# EAGLE design Maqam v2 (EAGLE 9.2.2)

## Sheet 1 of 2: Maqam v2.0 Board
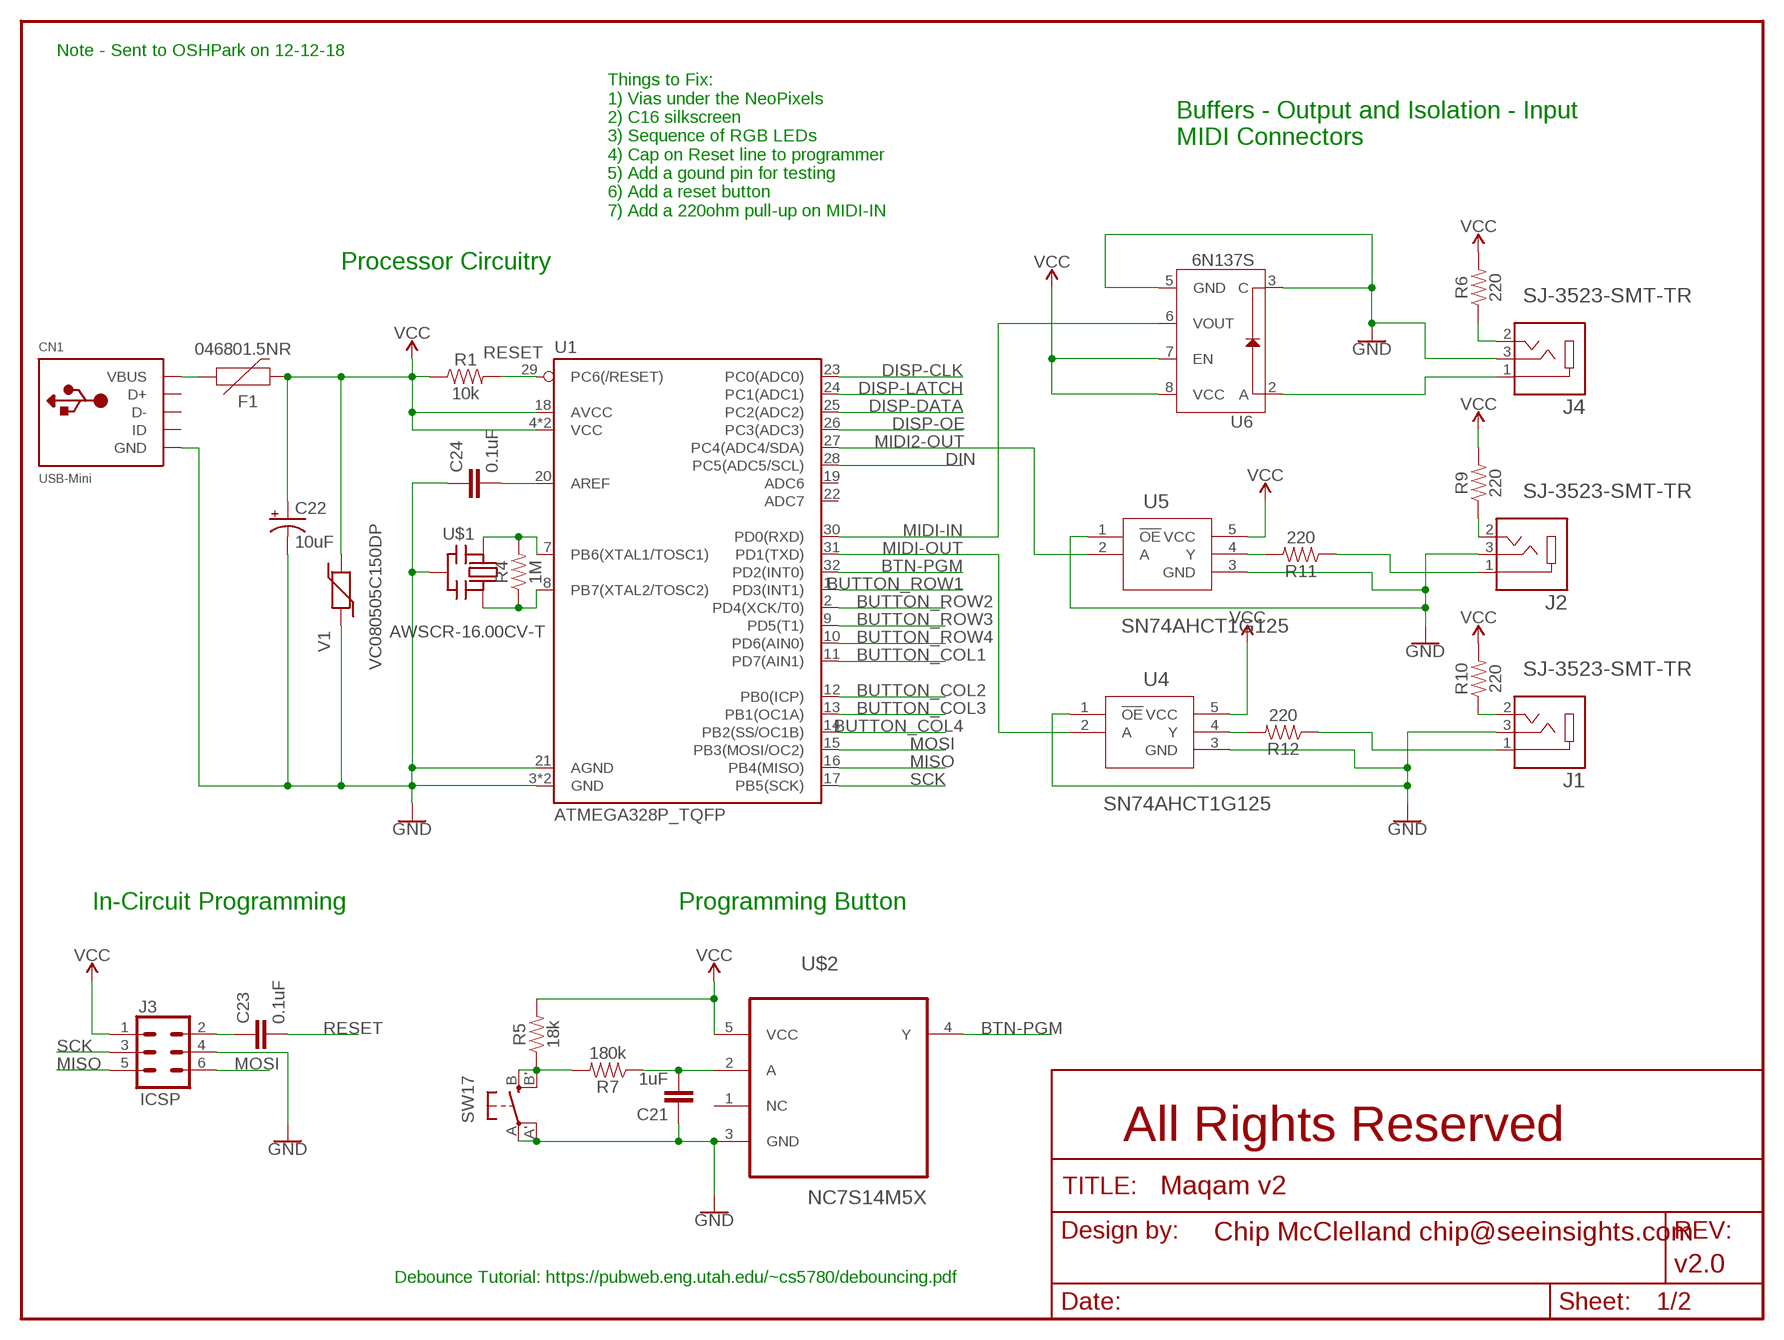
[diagram p0: schematic, sheet 1]

### Parts
C21  1uF  1.0UF-0805-25V-(+80/-20%)  [0805]
C22  10uF  10UF-POLAR-EIA3216-16V-10%(TANT)  [EIA3216]
C23  0.1uF  1.0UF-0805-25V-(+80/-20%)  [0805]
C24  0.1uF  1.0UF-0805-25V-(+80/-20%)  [0805]
CN1  USB-Mini  USBMINIB  [USB-MINIB]
F1  046801.5NR  PPTC_HALF-AMP  [1206]
FRAME2  FRAME-LETTERNO_PACKAGE  [DUMMY]
J1  SJ-3523-SMT-TR  [CUI_SJ-3523-SMT-TR]
J2  SJ-3523-SMT-TR  [CUI_SJ-3523-SMT-TR]
J3  ICSP  CONN_03X2SHROUD  [2X3-SHROUDED]
J4  SJ-3523-SMT-TR  [CUI_SJ-3523-SMT-TR]
R1  10k  RESISTOR0805  [0805]
R4  1M  RESISTOR0805  [0805]
R5  18k  RESISTOR0805  [0805]
R6  220  RESISTOR0805  [0805]
R7  180k  RESISTOR0805  [0805]
R9  220  RESISTOR0805  [0805]
R10  220  RESISTOR0805  [0805]
R11  220  RESISTOR0805  [0805]
R12  220  RESISTOR0805  [0805]
SW17  SPST_TACT-EVQQ2  [EVQ-Q2]
U1  ATMEGA328P_TQFP  [TQFP32-08]
U4  SN74AHCT1G125  SN74AHCT1G125DBVRDBV5-L  [DBV5-L]
U5  SN74AHCT1G125  SN74AHCT1G125DBVRDBV5-L  [DBV5-L]
U6  6N137S  [8-SMD]
U$1  AWSCR-16.00CV-T  CERMOSCILL  [AWSCR]
U$2  NC7S14M5X  [SOT-23-5]
V1  VC080505C150DP  VARISTOR  [0805]

### Nets
BTN-PGM: U1.32(PD2(INT0)) U$2.4(Y)
BUTTON_COL1: U1.11(PD7(AIN1)) ; also sheet 2
BUTTON_COL2: U1.12(PB0(ICP)) ; also sheet 2
BUTTON_COL3: U1.13(PB1(OC1A)) ; also sheet 2
BUTTON_COL4: U1.14(PB2(SS/OC1B)) ; also sheet 2
BUTTON_ROW1: U1.1(PD3(INT1)) ; also sheet 2
BUTTON_ROW2: U1.2(PD4(XCK/T0)) ; also sheet 2
BUTTON_ROW3: U1.9(PD5(T1)) ; also sheet 2
BUTTON_ROW4: U1.10(PD6(AIN0)) ; also sheet 2
DIN: U1.28(PC5(ADC5/SCL)) ; also sheet 2
DISP-CLK: U1.23(PC0(ADC0)) ; also sheet 2
DISP-DATA: U1.25(PC2(ADC2)) ; also sheet 2
DISP-LATCH: U1.24(PC1(ADC1)) ; also sheet 2
DISP-OE: U1.26(PC3(ADC3)) ; also sheet 2
GND: C21.1 C22.- C24.1 CN1.GND J1.3 J2.3 J3.4 J4.3 SW17.A'(P1) SW17.A(P) U1.3(GND) U1.5(GND) U1.21(AGND) U4.1(!OE) U4.3(GND) U5.1(!OE) U5.3(GND) U6.3(C) U6.5(GND) U$1.2(GND) U$2.3(GND) V1.1 ; also sheet 2
MIDI2-OUT: U1.27(PC4(ADC4/SDA)) U5.2(A)
MIDI-IN: U1.30(PD0(RXD)) U6.6(VOUT)
MIDI-OUT: U1.31(PD1(TXD)) U4.2(A)
MISO: J3.5 U1.16(PB4(MISO))
MOSI: J3.6 U1.15(PB3(MOSI/OC2))
N$14: C24.2 U1.20(AREF)
N$15: J1.1 R12.1
N$16: R4.1 U1.8(PB7(XTAL2/TOSC2)) U$1.3(OUT)
N$22: C23.1 J3.2
N$24: R4.2 U1.7(PB6(XTAL1/TOSC1)) U$1.1(IN)
N$26: J2.1 R11.1
N$27: J4.2 R6.1
N$28: J4.1 U6.2(A)
N$38: J1.2 R10.1
N$39: J2.2 R9.1
N$40: R12.2 U4.4(Y)
N$41: R11.2 U5.4(Y)
N$43: CN1.VBUS F1.1
N$47: R5.1 R7.2 SW17.B'(S1) SW17.B(S)
N$49: C21.2 R7.1 U$2.2(A)
RESET: C23.2 R1.2 U1.29(PC6(/RESET))
SCK: J3.3 U1.17(PB5(SCK))
VCC: C22.+ F1.2 J3.1 R1.1 R5.2 R6.2 R9.2 R10.2 U1.4(VCC) U1.6(VCC) U1.18(AVCC) U4.5(VCC) U5.5(VCC) U6.7(EN) U6.8(VCC) U$2.5(VCC) V1.2 ; also sheet 2
Unconnected: CN1.D+ CN1.D- CN1.ID U1.19(ADC6) U1.22(ADC7) U$2.1(NC)

### Notes on the sheet
- Note - Sent to OSHPark on 12-12-18
- Buffers - Output and Isolation - Input
  MIDI Connectors
- Things to Fix:
  1) Vias under the NeoPixels
  2) C16 silkscreen
  3) Sequence of RGB LEDs
  4) Cap on Reset line to programmer
  5) Add a gound pin for testing
  6) Add a reset button
  7) Add a 220ohm pull-up on MIDI-IN
- Processor Circuitry
- In-Circuit Programming | Programming Button
- All Rights Reserved
- Debounce Tutorial: https://pubweb.eng.utah.edu/~cs5780/debouncing.pdf

## Sheet 2 of 2
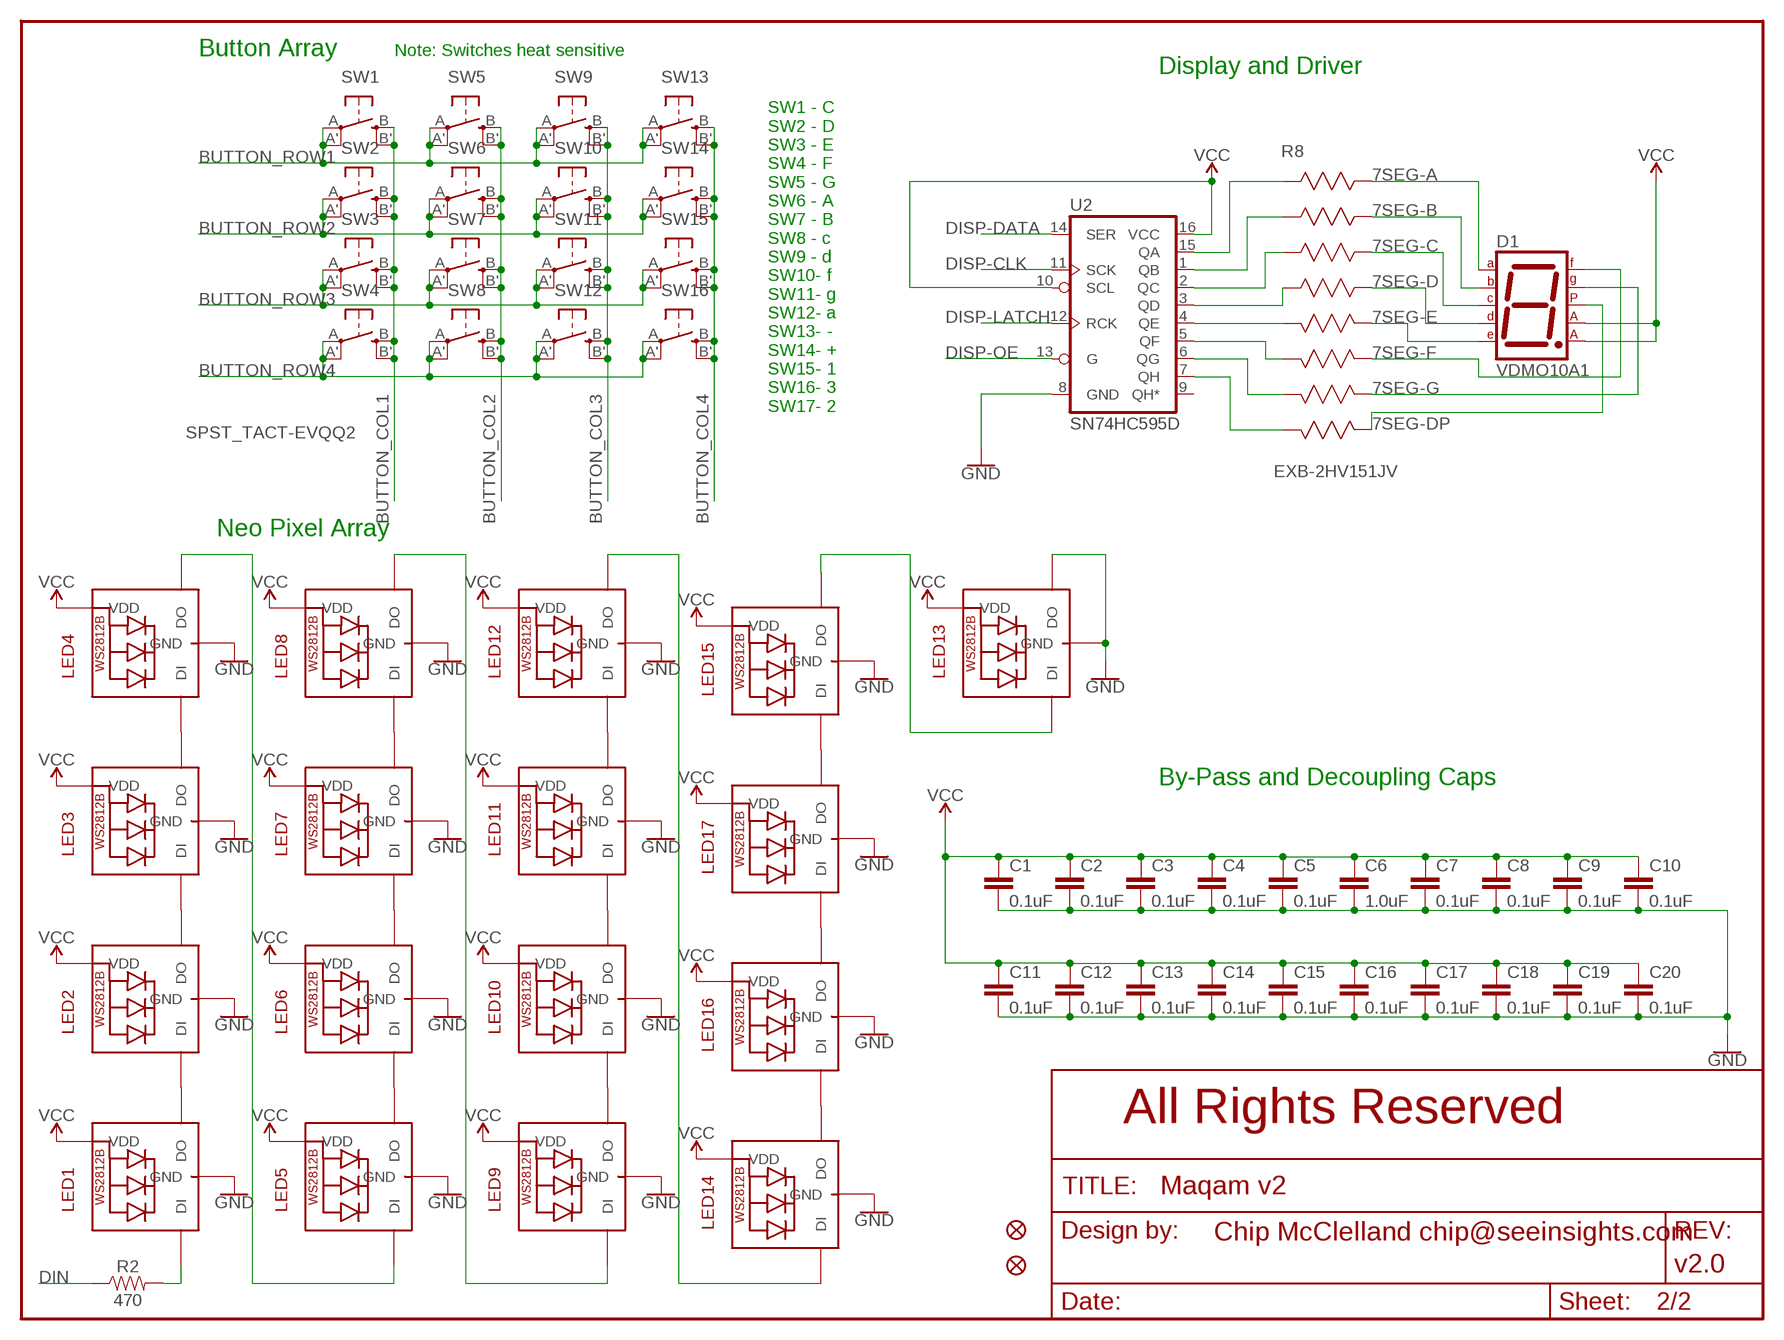
[diagram p1: schematic, sheet 2]

### Parts
C1  0.1uF  1.0UF-0805-25V-(+80/-20%)  [0805]
C2  0.1uF  1.0UF-0805-25V-(+80/-20%)  [0805]
C3  0.1uF  1.0UF-0805-25V-(+80/-20%)  [0805]
C4  0.1uF  1.0UF-0805-25V-(+80/-20%)  [0805]
C5  0.1uF  1.0UF-0805-25V-(+80/-20%)  [0805]
C6  1.0uF  1.0UF-0805-25V-(+80/-20%)  [0805]
C7  0.1uF  1.0UF-0805-25V-(+80/-20%)  [0805]
C8  0.1uF  1.0UF-0805-25V-(+80/-20%)  [0805]
C9  0.1uF  1.0UF-0805-25V-(+80/-20%)  [0805]
C10  0.1uF  1.0UF-0805-25V-(+80/-20%)  [0805]
C11  0.1uF  1.0UF-0805-25V-(+80/-20%)  [0805]
C12  0.1uF  1.0UF-0805-25V-(+80/-20%)  [0805]
C13  0.1uF  1.0UF-0805-25V-(+80/-20%)  [0805]
C14  0.1uF  1.0UF-0805-25V-(+80/-20%)  [0805]
C15  0.1uF  1.0UF-0805-25V-(+80/-20%)  [0805]
C16  0.1uF  1.0UF-0805-25V-(+80/-20%)  [0805]
C17  0.1uF  1.0UF-0805-25V-(+80/-20%)  [0805]
C18  0.1uF  1.0UF-0805-25V-(+80/-20%)  [0805]
C19  0.1uF  1.0UF-0805-25V-(+80/-20%)  [0805]
C20  0.1uF  1.0UF-0805-25V-(+80/-20%)  [0805]
D1  VDMO10A1  [7-SEG-SMD]
FD1  FIDUCIALUFIDUCIAL  [FIDUCIAL-MICRO]
FD2  FIDUCIALUFIDUCIAL  [FIDUCIAL-MICRO]
FRAME1  FRAME-LETTERNO_PACKAGE  [DUMMY]
LED1  WS2812B3535  [LED3535]
LED2  WS2812B3535  [LED3535]
LED3  WS2812B3535  [LED3535]
LED4  WS2812B3535  [LED3535]
LED5  WS2812B3535  [LED3535]
LED6  WS2812B3535  [LED3535]
LED7  WS2812B3535  [LED3535]
LED8  WS2812B3535  [LED3535]
LED9  WS2812B3535  [LED3535]
LED10  WS2812B3535  [LED3535]
LED11  WS2812B3535  [LED3535]
LED12  WS2812B3535  [LED3535]
LED13  WS2812B3535  [LED3535]
LED14  WS2812B3535  [LED3535]
LED15  WS2812B3535  [LED3535]
LED16  WS2812B3535  [LED3535]
LED17  WS2812B3535  [LED3535]
R2  470  RESISTOR0805  [0805]
R8  EXB-2HV151JV  EXB-2HV103JVEXB2HV-L  [EXB2HV-L]
SW1  SPST_TACT-EVQQ2  [EVQ-Q2]
SW2  SPST_TACT-EVQQ2  [EVQ-Q2]
SW3  SPST_TACT-EVQQ2  [EVQ-Q2]
SW4  SPST_TACT-EVQQ2  [EVQ-Q2]
SW5  SPST_TACT-EVQQ2  [EVQ-Q2]
SW6  SPST_TACT-EVQQ2  [EVQ-Q2]
SW7  SPST_TACT-EVQQ2  [EVQ-Q2]
SW8  SPST_TACT-EVQQ2  [EVQ-Q2]
SW9  SPST_TACT-EVQQ2  [EVQ-Q2]
SW10  SPST_TACT-EVQQ2  [EVQ-Q2]
SW11  SPST_TACT-EVQQ2  [EVQ-Q2]
SW12  SPST_TACT-EVQQ2  [EVQ-Q2]
SW13  SPST_TACT-EVQQ2  [EVQ-Q2]
SW14  SPST_TACT-EVQQ2  [EVQ-Q2]
SW15  SPST_TACT-EVQQ2  [EVQ-Q2]
SW16  SPST_TACT-EVQQ2  [EVQ-Q2]
U2  SN74HC595D  74HC595D  [SO16]

### Nets
7SEG-A: D1.7SEG7(A) R8.16
7SEG-B: D1.7SEG6(B) R8.15
7SEG-C: D1.7SEG4(C) R8.14
7SEG-D: D1.7SEG2(D) R8.13
7SEG-DP: D1.7SEG5(DP) R8.9
7SEG-E: D1.7SEG1(E) R8.12
7SEG-F: D1.7SEG9(F) R8.11
7SEG-G: D1.7SEG10(G) R8.10
BUTTON_COL1: SW1.B'(S1) SW1.B(S) SW2.B'(S1) SW2.B(S) SW3.B'(S1) SW3.B(S) SW4.B'(S1) SW4.B(S) ; also sheet 1
BUTTON_COL2: SW5.B'(S1) SW5.B(S) SW6.B'(S1) SW6.B(S) SW7.B'(S1) SW7.B(S) SW8.B'(S1) SW8.B(S) ; also sheet 1
BUTTON_COL3: SW9.B'(S1) SW9.B(S) SW10.B'(S1) SW10.B(S) SW11.B'(S1) SW11.B(S) SW12.B'(S1) SW12.B(S) ; also sheet 1
BUTTON_COL4: SW13.B'(S1) SW13.B(S) SW14.B'(S1) SW14.B(S) SW15.B'(S1) SW15.B(S) SW16.B'(S1) SW16.B(S) ; also sheet 1
BUTTON_ROW1: SW1.A'(P1) SW1.A(P) SW5.A'(P1) SW5.A(P) SW9.A'(P1) SW9.A(P) SW13.A'(P1) SW13.A(P) ; also sheet 1
BUTTON_ROW2: SW2.A'(P1) SW2.A(P) SW6.A'(P1) SW6.A(P) SW10.A'(P1) SW10.A(P) SW14.A'(P1) SW14.A(P) ; also sheet 1
BUTTON_ROW3: SW3.A'(P1) SW3.A(P) SW7.A'(P1) SW7.A(P) SW11.A'(P1) SW11.A(P) SW15.A'(P1) SW15.A(P) ; also sheet 1
BUTTON_ROW4: SW4.A'(P1) SW4.A(P) SW8.A'(P1) SW8.A(P) SW12.A'(P1) SW12.A(P) SW16.A'(P1) SW16.A(P) ; also sheet 1
DIN: R2.1 ; also sheet 1
DISP-CLK: U2.11(SCK) ; also sheet 1
DISP-DATA: U2.14(SER) ; also sheet 1
DISP-LATCH: U2.12(RCK) ; also sheet 1
DISP-OE: U2.13(G) ; also sheet 1
GND: C1.2 C2.2 C3.2 C4.2 C5.2 C6.2 C7.2 C8.2 C9.2 C10.2 C11.2 C12.2 C13.2 C14.2 C15.2 C16.2 C17.2 C18.2 C19.2 C20.2 LED1.4(GND) LED2.4(GND) LED3.4(GND) LED4.4(GND) LED5.4(GND) LED6.4(GND) LED7.4(GND) LED8.4(GND) LED9.4(GND) LED10.4(GND) LED11.4(GND) LED12.4(GND) LED13.3(DO) LED13.4(GND) LED14.4(GND) LED15.4(GND) LED16.4(GND) LED17.4(GND) U2.8(GND) ; also sheet 1
N$1: LED1.3(DO) LED2.1(DI)
N$2: LED3.3(DO) LED4.1(DI)
N$3: LED2.3(DO) LED3.1(DI)
N$4: LED7.3(DO) LED8.1(DI)
N$5: LED6.3(DO) LED7.1(DI)
N$6: LED5.3(DO) LED6.1(DI)
N$7: LED11.3(DO) LED12.1(DI)
N$8: LED10.3(DO) LED11.1(DI)
N$9: LED9.3(DO) LED10.1(DI)
N$10: LED14.3(DO) LED16.1(DI)
N$11: LED4.3(DO) LED5.1(DI)
N$12: LED8.3(DO) LED9.1(DI)
N$13: LED16.3(DO) LED17.1(DI)
N$17: R8.1 U2.15(QA)
N$18: LED15.1(DI) LED17.3(DO)
N$19: LED13.1(DI) LED15.3(DO)
N$20: R8.5 U2.4(QE)
N$21: R8.2 U2.1(QB)
N$23: R8.3 U2.2(QC)
N$25: LED1.1(DI) R2.2
N$30: R8.4 U2.3(QD)
N$32: R8.6 U2.5(QF)
N$34: R8.7 U2.6(QG)
N$36: R8.8 U2.7(QH)
N$46: LED12.3(DO) LED14.1(DI)
VCC: C1.1 C2.1 C3.1 C4.1 C5.1 C6.1 C7.1 C8.1 C9.1 C10.1 C11.1 C12.1 C13.1 C14.1 C15.1 C16.1 C17.1 C18.1 C19.1 C20.1 D1.7SEG3(CA1) D1.7SEG8(CA2) LED1.2(VDD) LED2.2(VDD) LED3.2(VDD) LED4.2(VDD) LED5.2(VDD) LED6.2(VDD) LED7.2(VDD) LED8.2(VDD) LED9.2(VDD) LED10.2(VDD) LED11.2(VDD) LED12.2(VDD) LED13.2(VDD) LED14.2(VDD) LED15.2(VDD) LED16.2(VDD) LED17.2(VDD) U2.10(SCL) U2.16(VCC) ; also sheet 1
Unconnected: U2.9(QH*)

### Notes on the sheet
- Button Array | Note: Switches heat sensitive
- Display and Driver
- SW1 - C
  SW2 - D
  SW3 - E
  SW4 - F
  SW5 - G
  SW6 - A
  SW7 - B
  SW8 - c
  SW9 - d
  SW10- f
  SW11- g
  SW12- a
  SW13- -
  SW14- +
  SW15- 1
  SW16- 3
  SW17- 2
- Neo Pixel Array
- By-Pass and Decoupling Caps
- All Rights Reserved

## Library data of the parts
C1-C5 C7-C21 C23 C24 = SparkFun-Capacitors:1.0UF: 1µF ceramic capacitors A capacitor is a passive two-terminal electrical component used to store electrical energy temporarily in an electric field.; PROD_ID: CAP-11625; VALUE: 1.0uF
C6 = SparkFun-Capacitors:1.0UF: 1µF ceramic capacitors A capacitor is a passive two-terminal electrical component used to store electrical energy temporarily in an electric field.; PROD_ID: CAP-11625
C22 = SparkFun-Capacitors:10UF-POLAR: 10.0µF polarized capacitors A capacitor is a passive two-terminal electrical component used to store electrical energy temporarily in an electric field.; PROD_ID: CAP-00811
CN1 = adafruit:USB: USB Connectors USBMINIB - Surface Mount Female Mini-B USB Connector 4UConnector: 06564 By microbuilder.eu Thru-hole RA Female Mini-B USB Connector 4UConnector: 18732 By ladyada.net
D1 = Custom Components:VDMO10A1
F1 = SparkFun-Fuses:PPTC: Resettable Fuse PPTC Resettable Fuse. Really a sort of resistor with a polymeric positive temperature coefficient whose resistance increases dramatically with an increase in temperature. When heated by the power passing through the resistance rises causing the current to be limited, protecting the circuit. This is achieved by the transition of the polymer from a crystalline to an amorphous state where the conductive carbon separates breaking the conductive pathways found in the cool crystalline structure. When a PPTC cools back down it resumes conducting letting the circuit turn back on. SparkFun Products: SparkFun RedBoard - Programmed with Arduino <https://www.sparkfun.com/products/12757> Pro Micro - 5V/16MHz <https://www.sparkfun.com/products/12640> Arduino Pro 328 - 5V/16MHz <https://www.sparkfun.com/products/10915> MP3 Trigger <https://www.sparkfun.com/products/13720>; PROD_ID: RES-08585; VALUE: 6V/0.5A
FD1 FD2 = SparkFun-Aesthetics:FIDUCIAL: Fiducial Alignment Points Point-of-reference for pick-and-place machines and other optical instruments.
FRAME1 FRAME2 = SparkFun-Aesthetics:FRAME-LETTER: Schematic Frame - Letter Standard 8.5x11 US Letter frame; DESIGNER: Chip McClelland chip@seeinsights.com; REV: v2.0; VERSION: v2.0
J1 J2 J4 = SJ-3523-SMT-TR:SJ-3523-SMT-TR: Audio Jack Connector 3.5 mm Low Profile Surface Mount Stereo Jack, 3 Pin Right-Angle; CUI_PURCHASE_URL: https://www.cui.com/product/interconnect/audio-connectors/3.5-mm-jacks/sj-352x-smt-series?utm_source=snapeda.com&utm_medium=referral&utm_campaign=snapedaBOM; DESCRIPTION: SJ Series 3.5 mm 12 V SMT Right Angle Stereo Audio Jack; DIGI-KEY_PART_NUMBER: CP-3523SJCT-ND; DIGI-KEY_PURCHASE_URL: https://www.digikey.com/product-detail/en/cui-inc/SJ-3523-SMT-TR/CP-3523SJCT-ND/669704?utm_source=snapeda&utm_medium=aggregator&utm_campaign=symbol; MF: CUI Inc.; MP: SJ-3523-SMT-TR; PACKAGE: LGA-10 STMicroelectronics
J3 = SparkFun-Connectors:CONN_03X2: Multi connection point. Often used as Generic Header-pin footprint for 0.1 inch spaced/style header connections You can populate with any combo of single row headers, but if you'd like an exact match, check these: Header - 2x3 (Male, 0.1") <https://www.sparkfun.com/products/12807> (PRT-12807) Header - 2x3 (Female, 0.1") <https://www.sparkfun.com/products/13010> (PRT-13010) 2x3 Pin Shrouded Header <https://www.sparkfun.com/products/10877> (PRT-10877) On any of the 0.1 inch spaced packages, you can populate with these: Break Away Headers - Straight <https://www.sparkfun.com/products/116> (PRT-00116) Break Away Male Headers - Right Angle <https://www.sparkfun.com/products/553> (PRT-00553) Female Headers <https://www.sparkfun.com/products/115> (PRT-00115) Break Away Headers - Machine Pin <https://www.sparkfun.com/products/117> (PRT-00117) Break Away Female Headers - Swiss Machine Pin <https://www.sparkfun.com/products/743> (PRT-00743) Special note: the shrouded connector mates well with our 3x2 ribbon cables: Ribbon Crimp Connector - 6-pin (2x3, Female) <https://www.sparkfun.com/products/10651> (PRT-10651) Ribbon Cable - 6 wire (15ft) <https://www.sparkfun.com/products/10646> (PRT-10646); PROD_ID: CONN-10681; SF_ID: PRT_10877
LED1-LED17 = adafruit:WS2812B
R1 R2 R4-R7 R9-R12 = SparkFun-Resistors:RESISTOR: Generic Resistor Package
R8 = Custom Components:EXB-2HV103JV; MANUFACTURER_PART_NUMBER: EXB2HV103JV; VENDOR: Panasonic
SW1-SW17 = adafruit:SPST_TACT: SMT 6mm switch, EVQQ2 series http://www.ladyada.net/library/eagle
U1 = SparkFun-IC-Microcontroller:ATMEGA328P_TQFP: Popular 328P in QFP Storefront component: ATmega328 - TQFP <https://www.sparkfun.com/products/13448> (COM-13448) Datasheet <http://www.sparkfun.com/datasheets/Components/SMD/ATMega328.pdf> SparkFun Products SparkFun RedBoard - Programmed with Arduino <https://www.sparkfun.com/products/12757> (DEV-12757) Arduino Pro Mini 328 - 5V/16MHz <https://www.sparkfun.com/products/11113> (DEV-11113) Arduino Pro Mini 328 - 3.3V/8MHz <https://www.sparkfun.com/products/11114> (DEV-11114) SparkFun OpenLog <https://www.sparkfun.com/products/13712> (DEV-13712) SparkFun MicroView - OLED Arduino Module <https://www.sparkfun.com/products/12923> (DEV-12923) SparkFun Digital Sandbox <https://www.sparkfun.com/products/12651> (DEV-12651) SparkFun PicoBoard <https://www.sparkfun.com/products/11888> (WIG-11888) Arduino Fio <https://www.sparkfun.com/products/10116> (DEV-10116) LilyPad Arduino 328 Main Board <https://www.sparkfun.com/products/13342> (DEV-13342) SparkFun RedStick <https://www.sparkfun.com/products/13741> (DEV-13741) LilyPad MP3 <https://www.sparkfun.com/products/11013> (DEV-11013) LilyPad Arduino SimpleSnap <https://www.sparkfun.com/products/10941> (DEV-10941) SparkFun Stepoko <https://www.sparkfun.com/products/13899> (ROB-13899) SparkFun Geiger Counter <https://www.sparkfun.com/products/11345> (SEN-11345) SparkFun EL Sequencer <https://www.sparkfun.com/products/12781> (COM-12781) Arduino Pro 328 - 5V/16MHz <https://www.sparkfun.com/products/10915> (DEV-10915) CryptoCape <https://www.sparkfun.com/products/12773> (DEV-12773) SparkFun IR Thermometer Evaluation Board - MLX90614 <https://www.sparkfun.com/products/10740> (SEN-10740) SparkFun RedBot Mainboard <https://www.sparkfun.com/products/12097> (ROB-12097) Arduino Pro 328 - 3.3V/8MHz <https://www.sparkfun.com/products/10914> (DEV-10914) SparkFun Block for Intel® Edison - Arduino <https://www.sparkfun.com/products/13036> (DEV-13036) SparkFun Simon Says - Surface Mount Soldering Kit <https://www.sparkfun.com/products/10935> (KIT-10935) SparkFun 7-Segment Serial Display - Red <https://www.sparkfun.com/products/11441> (COM-11441) SparkFun 7-Segment Serial Display - White <https://www.sparkfun.com/products/11629> (COM-11629) SparkFun 7-Segment Serial Display - Yellow <https://www.sparkfun.com/products/11443> (COM-11443) SparkFun 7-Segment Serial Display - Kelly Green <https://www.sparkfun.com/products/11440> (COM-11440) SparkFun 7-Segment Serial Display - Blue <https://www.sparkfun.com/products/11442> (COM-11442) SparkFun OpenSegment Serial Display - 20mm (Blue) <https://www.sparkfun.com/products/11647> (COM-11647) SparkFun OpenSegment Serial Display - 20mm (Green) <https://www.sparkfun.com/products/11646> (COM-11646) SparkFun OpenSegment Serial Display - 20mm (White) <https://www.sparkfun.com/products/11648> (COM-11648) SparkFun OpenSegment Serial Display - 20mm (Red) <https://www.sparkfun.com/products/11644> (COM-11644) SparkFun OpenSegment Serial Display - 20mm (Yellow) <https://www.sparkfun.com/products/11645> (COM-11645) SparkFun OpenSegment Shield <https://www.sparkfun.com/products/13190> (DEV-13190); PROD_ID: IC-09069
U2 = SparkFun-IC-Logic:74*595: 8-Bit Shift Register (Serial to Parallel) Datasheet <http://cdn.sparkfun.com/datasheets/BreakoutBoards/MM74HC595.pdf> SparkFun Products SparkFun Shift Register Breakout - 74HC595 <https://www.sparkfun.com/products/10680> (BOB-10680); PROD_ID: IC-07875
U4 U5 = Custom Components:SN74AHCT1G125DBVR; MANUFACTURER_PART_NUMBER: SN74AHCT1G125DBVR; VENDOR: Texas Instruments
U6 = SparkFun-DiscreteSemi:6N137S: Lite-On 6N137 - High Speed Opto Isolator Opto isolator capable of data rates up to 10MBd; PROD_ID: IC-14151
U$1 = adafruit:CERMOSCILL: Ceramic oscillator with built in capacitors such as ZTT-12MHz http://www.ladyada.net/library/eagle
U$2 = Custom Components:NC7S14M5X: Schmidt Trigger with Inverter
V1 = Custom Components:VARISTOR

## Net classes
0 default: width 0.203 mm, drill 0.33 mm

## Board
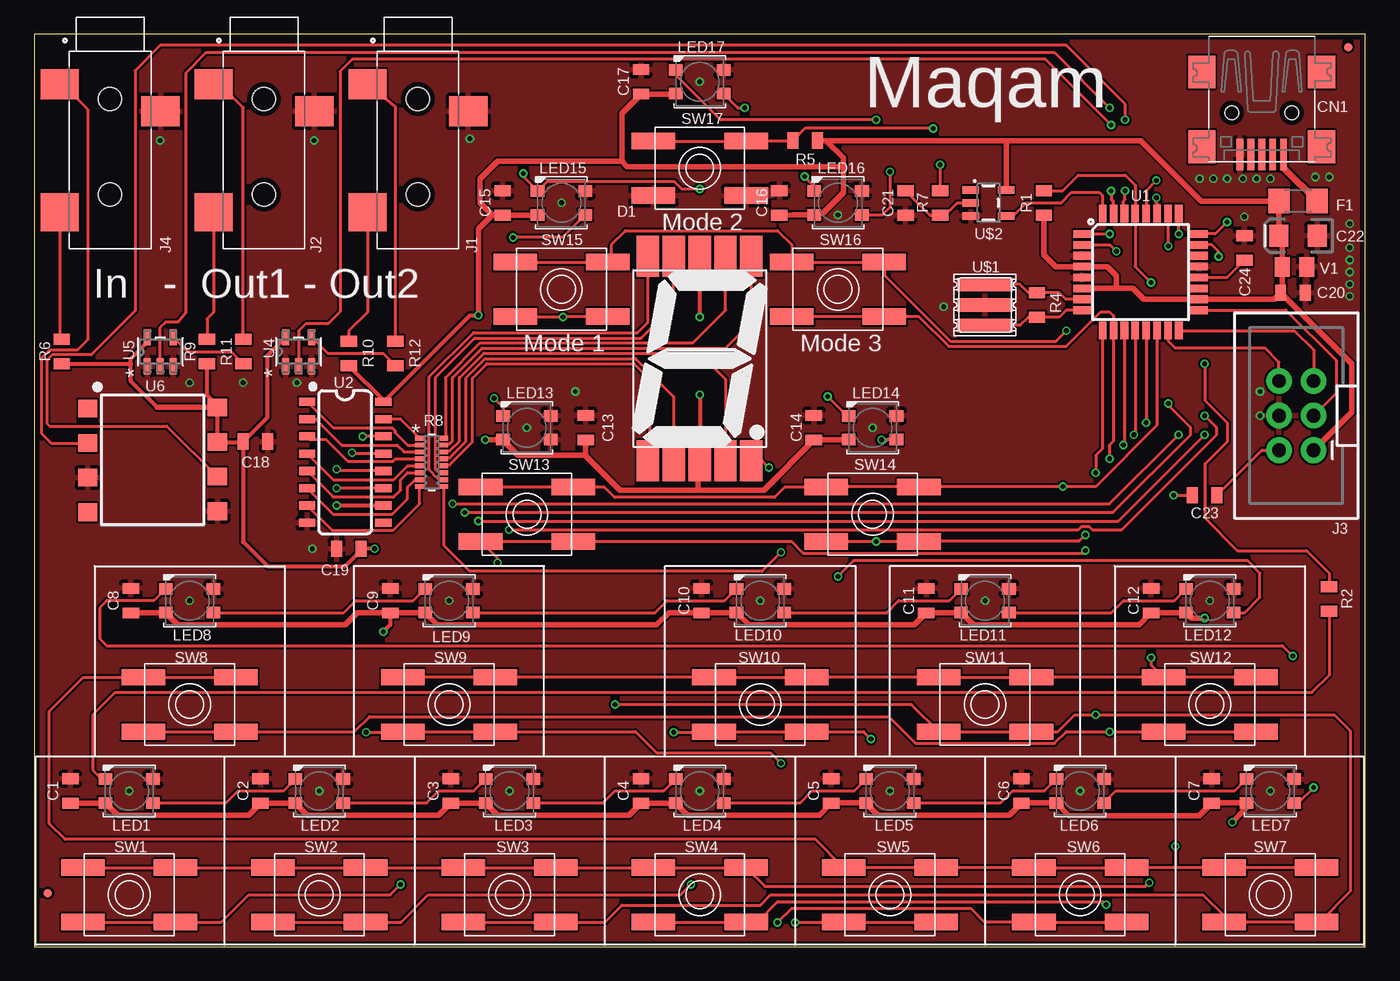
[diagram p2: board, top side]
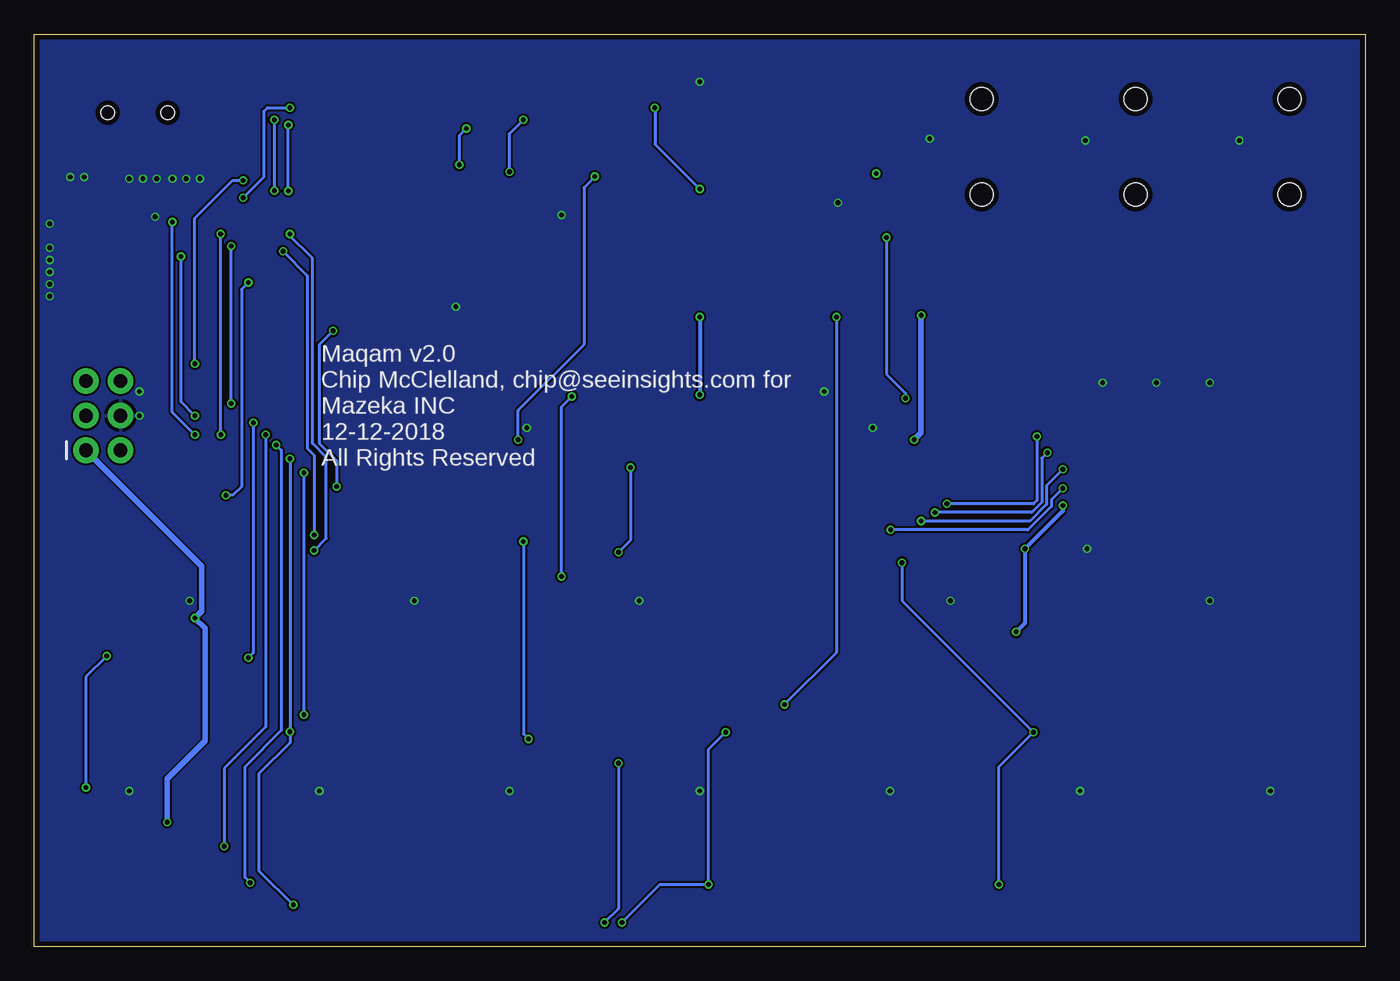
[diagram p3: board, bottom side, seen from below]

Size 97.79 x 67.01 mm. Coordinates in mm from the lower left corner, seen from the top.
Outline: 0,0 97.79,0 97.79,67 0,67 0,0
Copper layers (1*16): Top 0.035559375mm / dielectric 1.6mm / Bottom 0.035559375mm
Design rules "oshpark-2layer": minimum track width 6mil, minimum drill 10mil, track to track 6mil, track to pad 6mil, pad to pad 6mil, via to via 6mil, smd to smd 6mil, copper to edge 15mil, drill to drill 6mil, minimum pad ring 5mil, minimum via ring 5mil, stop-mask expansion 2.5mil, vias tented up to drill 0mil, thermal gap 10mil

### Footprints (pad centres in the part's own frame; a part is rotated, then mirrored left to right if it is on the bottom)
0805 = smd 0.8 x 1.2: 1 -0.9,0; 2 0.9,0
EIA3216 = smd 1.4 x 1.6: + 1.4,0; - -1.4,0
USB-MINIB = smd 0.5 x 2.308: D+ 0,4.064; D- -0.8,4.064; GND 1.6,4.064; ID 0.8,4.064; VBUS -1.6,4.064 | smd 2 x 2.4: GND1 -4.4,-2; GND2 -4.4,3.5; GND3 4.4,3.5; GND4 4.4,-2 | hole 1: -2.2,1; 2.2,1
7-SEG-SMD = smd 1.65 x 3: 7SEG1 -3.81,-7.5; 7SEG2 -1.91,-7.5; 7SEG3 -0.01,-7.5; 7SEG4 1.89,-7.5; 7SEG5 3.79,-7.5; 7SEG6 3.79,7.5; 7SEG7 1.89,7.5; 7SEG8 -0.01,7.5; 7SEG9 -1.91,7.5; 7SEG10 -3.81,7.5
1206 = smd 1.6 x 1.8: 1 -1.4,0; 2 1.4,0
FIDUCIAL-MICRO = smd 0.635 x 0.635: 1 0,0
CUI_SJ-3523-SMT-TR = smd 2.2 x 2.8: 1 -1.1,-3.7; 3 0.9,3.7 | smd 2.8 x 2.8: 2 8.3,-3.7 | hole 1.7: 0,0; 7,0
2X3-SHROUDED = drill 1.016 pad 1.88: 1 -1.27,2.54; 2 1.27,2.54; 3 -1.27,0; 4 1.27,0; 5 -1.27,-2.54; 6 1.27,-2.54
LED3535 = smd 1 x 0.85: 1 -1.75,0.875; 2 -1.75,-0.875; 3 1.75,-0.875; 4 1.75,0.875
EXB2HV-L = smd 0.66 x 0.356: 1 -0.876,1.778; 2 -0.876,1.27; 3 -0.876,0.762; 4 -0.876,0.254; 5 -0.876,-0.254; 6 -0.876,-0.762; 7 -0.876,-1.27; 8 -0.876,-1.778; 9 0.876,-1.778; 10 0.876,-1.27; 11 0.876,-0.762; 12 0.876,-0.254; 13 0.876,0.254; 14 0.876,0.762; 15 0.876,1.27; 16 0.876,1.778
EVQ-Q2 = smd 3.2 x 1.2: A -3.4,-2; A' 3.4,-2; B -3.4,2; B' 3.4,2
TQFP32-08 = smd 1.27 x 0.559: 1 -4.293,2.8; 2 -4.293,2; 3 -4.293,1.2; 4 -4.293,0.4; 5 -4.293,-0.4; 6 -4.293,-1.2; 7 -4.293,-2; 8 -4.293,-2.8; 17 4.293,-2.8; 18 4.293,-2; 19 4.293,-1.2; 20 4.293,-0.4; 21 4.293,0.4; 22 4.293,1.2; 23 4.293,2; 24 4.293,2.8 | smd 0.559 x 1.27: 9 -2.8,-4.293; 10 -2,-4.293; 11 -1.2,-4.293; 12 -0.4,-4.293; 13 0.4,-4.293; 14 1.2,-4.293; 15 2,-4.293; 16 2.8,-4.293; 25 2.8,4.293; 26 2,4.293; 27 1.2,4.293; 28 0.4,4.293; 29 -0.4,4.293; 30 -1.2,4.293; 31 -2,4.293; 32 -2.8,4.293
SO16 = smd 0.6 x 1.2: 1 -4.445,-2.8; 2 -3.175,-2.8; 3 -1.905,-2.8; 4 -0.635,-2.8; 5 0.635,-2.8; 6 1.905,-2.8; 7 3.175,-2.8; 8 4.445,-2.8; 9 4.445,2.8; 10 3.175,2.8; 11 1.905,2.8; 12 0.635,2.8; 13 -0.635,2.8; 14 -1.905,2.8; 15 -3.175,2.8; 16 -4.445,2.8
DBV5-L = smd 1.168 x 0.508: 1 -1.067,0.95; 2 -1.067,0; 3 -1.067,-0.95; 4 1.067,-0.95; 5 1.067,0.95
8-SMD = smd 1.3 x 1.4: 1 -3.96,-4.96; 2 -1.42,-4.96; 3 1.12,-4.96; 4 3.66,-4.96; 5 3.59,4.58; 6 1.05,4.58; 7 -1.49,4.58; 8 -4.03,4.58
AWSCR = smd 1 x 4.1: 1 -1.5,0; 2 0,0; 3 1.5,0
SOT-23-5 = smd 0.55 x 1.2: 1 -0.95,-1.3; 2 0,-1.3; 3 0.95,-1.3; 4 0.95,1.3; 5 -0.95,1.3
0805' = smd 1.118 x 1.448: 1 -0.902,0; 2 0.902,0

### Placement (x,y rotation side)
C1  2.67,11.43 90 top
C2  16.64,11.43 90 top
C3  30.61,11.43 90 top
C4  44.58,11.43 90 top
C5  58.55,11.43 90 top
C6  72.52,11.43 90 top
C7  86.49,11.43 90 top
C8  7.11,25.4 90 top
C9  26.16,25.4 90 top
C10  49.02,25.4 90 top
C11  65.53,25.4 90 top
C12  82.04,25.4 90 top
C13  40.51,38.1 90 top
C14  57.28,38.1 90 top
C15  34.42,54.61 90 top
C16  54.74,54.61 90 top
C17  44.58,63.5 90 top
C18  16.26,37.08 0 top
C19  23.11,29.21 180 top
C20  92.46,48.01 0 top
C21  64.01,54.61 90 top
C22  92.84,52.2 180 top
C23  85.98,33.15 180 top
C24  88.9,51.31 270 top
CN1  90.17,62.23 180 top
D1  48.9,43.18 0 top
F1  92.84,54.74 180 top
FD1  96.52,66.04 0 top
FD2  1.02,3.94 0 top
FRAME1  21.59,-8.89 0 top  (outside the outline)
FRAME2  -6.35,-30.48 0 top  (outside the outline)
J1  28.19,62.23 270 top
J2  16.89,62.23 270 top
J3  92.71,38.99 180 top
J4  5.59,62.23 270 top
LED1  6.99,11.43 0 top
LED2  20.95,11.43 0 top
LED3  34.92,11.43 0 top
LED4  48.9,11.43 0 top
LED5  62.87,11.43 0 top
LED6  76.83,11.43 0 top
LED7  90.81,11.43 0 top
LED8  11.43,25.4 0 top
LED9  30.48,25.4 0 top
LED10  53.34,25.4 0 top
LED11  69.85,25.4 0 top
LED12  86.36,25.4 0 top
LED13  36.2,38.1 0 top
LED14  61.59,38.1 0 top
LED15  38.73,54.61 0 top
LED16  59.05,54.61 0 top
LED17  48.9,63.5 0 top
R1  74.17,54.61 90 top
R2  95.12,25.53 270 top
R4  73.66,47.12 90 top
R5  56.64,59.18 0 top
R6  2.03,43.69 270 top
R7  66.55,54.61 90 top
R8  29.21,35.56 0 top
R9  12.7,43.69 270 top
R10  23.11,43.56 270 top
R11  15.37,43.69 270 top
R12  26.54,43.56 270 top
SW1  6.99,3.81 0 top
SW2  20.95,3.81 0 top
SW3  34.92,3.81 0 top
SW4  48.9,3.81 0 top
SW5  62.87,3.81 0 top
SW6  76.83,3.81 0 top
SW7  90.81,3.81 0 top
SW8  11.43,17.78 0 top
SW9  30.48,17.78 0 top
SW10  53.34,17.78 0 top
SW11  69.85,17.78 0 top
SW12  86.36,17.78 0 top
SW13  36.2,31.75 0 top
SW14  61.59,31.75 0 top
SW15  38.73,48.26 0 top
SW16  59.05,48.26 0 top
SW17  48.9,57.15 0 top
U1  81.28,49.53 0 top
U2  22.86,35.56 270 top
U4  19.43,43.69 90 top
U5  9.27,43.69 90 top
U6  8.89,35.56 270 top
U$1  69.85,47.12 270 top
U$2  70.1,54.61 270 top
V1  VC080505C150DP  [0805']  92.58,49.91 180 top

### Tracks (layer width: path | path; a pad name or v marks a point on that pad's centre or on a via)
7SEG-A
  Top 0.203: R8.16 30.21,37.47 30.21,41.77 32.77,44.32 48.39,44.32 50.8,46.74 50.78,46.75 D1.7SEG7
7SEG-B
  Top 0.203: R8.15 30.16,36.91 30.52,36.91 30.73,37.12 30.73,41.78 32.89,43.94 50.8,43.94 52.69,45.83 D1.7SEG6
7SEG-C
  Top 0.203: R8.14 30.16,36.4 30.52,36.4 31.24,37.12 31.24,41.78 33.05,43.59 48.87,43.59 50.8,41.66 50.8,35.7 D1.7SEG4
7SEG-D
  Top 0.203: R8.13 30.16,35.89 30.52,35.89 31.73,37.09 31.73,41.76 33.14,43.18 44.2,43.18 46.98,40.39 D1.7SEG2
7SEG-DP  (via drill 0.35)
  Top 0.203: v54.86,28.96 53.47,27.56 31.99,27.56 30.09,29.46 R8.9 | v53.98,35.18 53.47,35.68 D1.7SEG5
  Bottom 0.203: v53.98,35.18 53.98,29.84 v54.86,28.96
7SEG-E
  Top 0.203: R8.12 30.16,35.38 30.52,35.38 32.21,37.07 32.21,41.74 33.27,42.8 44.07,42.8 45.21,41.66 45.21,35.81 D1.7SEG1
7SEG-F
  Top 0.203: R8.11 30.01,34.87 29.65,34.87 29.5,35.02 29.5,41.82 32.37,44.68 44.58,44.68 46.98,47.09 D1.7SEG9
7SEG-G
  Top 0.203: R8.10 30.01,34.37 29.65,34.37 29.02,35 29.02,41.84 32.27,45.09 44.32,45.09 45.09,45.85 D1.7SEG10
BTN-PGM
  Top 0.203: U$2.4 71.95,53.66 72.9,54.61 75.44,54.61 76.2,55.37 78.23,55.37 78.49,55.12 78.48,55.11 U1.32
BUTTON_COL1  (via drill 0.35)
  Top 0.203: SW1.B SW1.B' SW2.B SW2.B' SW3.B SW3.B' SW4.B SW4.B' 53.69,4.42 81.64,4.42 v81.92,4.7 | U1.11 80.08,36.9 v80.01,36.83
  Bottom 0.203: v80.01,36.83 79.63,36.45 79.63,15.87 82.3,13.21 82.3,5.08 v81.92,4.7
BUTTON_COL2  (via drill 0.35)
  Top 0.203: SW7.B' SW7.B 83.82,5.81 | 83.82,5.81 SW6.B' SW6.B SW5.B' SW5.B 57.4,7.87 2.29,7.87 1.12,9.04 1.12,17.27 3.63,19.78 SW8.B SW8.B' | U1.12 80.88,37.7 v80.77,37.59 | v83.82,7.37 83.82,5.81
  Bottom 0.203: v80.77,37.59 80.77,16.13 83.82,13.09 v83.82,7.37
BUTTON_COL3  (via drill 0.35)
  Top 0.203: SW9.B SW9.B' SW10.B SW10.B' SW11.B SW11.B' SW12.B | SW12.B' SW12.B | U1.13 v81.68,38.46 | v82.04,21.21 82.04,20.7 SW12.B
  Bottom 0.203: v82.04,21.21 81.68,21.57 v81.68,38.46
BUTTON_COL4  (via drill 0.35)
  Top 0.203: SW13.B SW13.B' 41.88,33.75 42.64,32.99 54.38,32.99 55.15,33.75 SW14.B SW14.B' 66.3,33.78 v75.56,33.78 77.98,33.78 82.48,38.28 U1.14 | SW15.B SW15.B' 42.42,50.54 42.42,51.56 43.43,52.58 54.61,52.58 55.66,51.53 SW16.B SW16.B' 62.45,49.3 67.31,44.45 75.06,44.45 v75.82,45.21
  Bottom 0.203: v75.82,45.21 76.83,44.2 76.83,36.96 75.56,35.69 v75.56,33.78
BUTTON_ROW1  (via drill 0.35)
  Top 0.203: SW1.A SW1.A' 13.75,1.81 15.75,3.81 26.16,3.81 v26.92,4.57 | SW5.A' SW5.A 59.43,1.78 v55.88,1.78 | v24.38,15.75 27.05,15.75 SW9.A SW9.A' 44.16,15.78 45.72,14.22 54.1,14.22 v54.86,13.46 | v77.22,29.08 77.03,28.9 56.49,28.9 55.64,29.75 SW13.A' SW13.A 34.04,28.51 v34.04,28.19 | v78.99,52.32 U1.1
  Bottom 0.203: v26.92,4.57 26.92,13.21 v24.38,15.75 34.04,25.4 v34.04,28.19 | v54.86,13.46 54.86,2.79 v55.88,1.78 | v77.22,29.08 76.33,29.97 76.33,35.94 77.34,36.96 77.34,50.55 79.12,52.32 v78.99,52.32
BUTTON_ROW2  (via drill 0.35)
  Top 0.203: SW2.A SW2.A' 26.96,1.81 28.96,3.81 47.5,3.81 v48.26,4.57 | SW6.A' SW6.A 69.82,1.81 68.83,2.79 55.63,2.79 v54.61,1.78 | v46.99,15.75 49.91,15.75 SW10.A SW10.A' 60.93,15.78 v61.47,15.24 | SW14.A v61.85,29.75 SW14.A' 76.74,29.75 v77.22,30.23 | U1.2 79.03,51.53 v79.5,51.05
  Bottom 0.203: v46.99,15.75 48.26,14.48 v48.26,4.57 51.82,4.57 v54.61,1.78 | v61.47,15.24 61.85,15.62 v61.85,29.75 | v79.5,51.05 77.72,49.28 77.72,36.58 77.22,36.07 v77.22,30.23
BUTTON_ROW3  (via drill 0.35)
  Top 0.203: SW3.A SW3.A' 41.94,1.81 43.18,3.05 53.34,3.05 54.1,3.81 85.85,3.81 87.41,2.26 SW7.A SW7.A' 94.42,1.81 96.67,4.06 96.67,15.85 95.5,17.02 v77.98,17.02 76.45,17.02 75.22,15.78 SW11.A' SW11.A 64.45,17.78 v42.67,17.78 | SW15.A' 38.89,46.26 v38.86,46.23 35.37,46.23 SW15.A | U1.9 78.48,36.57 77.98,36.07 v77.98,34.8
  Bottom 0.203: v38.86,46.23 38.86,21.59 v42.67,17.78 | v77.98,34.8 v77.98,17.02
BUTTON_ROW4  (via drill 0.35)
  Top 0.203: SW4.A SW4.A' 53.12,1.81 54.61,3.3 78.49,3.3 78.72,3.07 v78.74,3.07 | SW8.A SW8.A' 23.52,15.78 24.63,16.89 62.78,16.89 64.75,14.93 74.95,14.93 75.81,15.78 v78.99,15.78 82.99,15.78 83.03,15.75 83.06,15.78 | SW12.A 83.06,15.78 | 83.06,15.78 SW12.A' | SW16.A SW16.A' 64.99,46.26 67.18,44.07 75.82,44.07 78.36,46.61 78.99,46.61 79.28,46.32 U1.10 79.28,37.12 78.99,36.83 v78.99,35.81
  Bottom 0.203: v78.99,35.81 v78.99,15.78 78.99,14.99 81.28,12.7 81.28,5.59 78.76,3.07 v78.74,3.07
DIN  (via drill 0.35)
  Top 0.203: v82.42,56.26 81.68,55.52 U1.28 | R2.1 95.12,27.43 93.47,29.08 88.39,29.08 85.98,31.5 85.98,35.43 87.63,37.08 87.63,38.48 85.98,40.13 v85.98,42.8
  Bottom 0.203: v85.98,42.8 85.98,53.47 83.19,56.26 v82.42,56.26
DISP-CLK  (via drill 0.35)
  Top 0.203: U2.11 22.35,33.66 v22.22,33.66 | v34.88,30.61 76.71,30.61 76.95,30.86 77.48,30.86 77.72,30.61 79.89,30.61 86.87,37.59 86.87,38.1 v85.98,38.99 | v87,50.67 87,51.05 86.52,51.53 U1.23
  Bottom 0.203: v22.22,33.66 23.06,32.82 23.06,32.32 24.78,30.61 34.87,30.61 v34.88,30.61 | v85.98,38.99 87,40.01 v87,50.67
DISP-DATA  (via drill 0.35)
  Top 0.203: U2.14 24.26,37.47 24.13,37.34 v24.13,37.46 | v30.73,32.51 78.99,32.51 v84.07,37.59 | v84.07,52.32 v84.08,52.33 U1.25
  Bottom 0.203: v24.13,37.46 24.13,32.77 24.38,32.51 v30.73,32.51 | v84.07,37.59 v84.07,52.32
DISP-LATCH  (via drill 0.35)
  Top 0.203: U2.12 22.35,34.92 v22.23,35.05 | v32.64,31.25 79.64,31.25 v85.98,37.59 | v87.63,53.21 86.75,52.33 U1.24
  Bottom 0.203: v22.23,35.05 23.42,33.86 23.42,32.47 24.65,31.24 v32.64,31.24 v32.64,31.25 | v85.98,37.59 87.63,39.25 v87.63,53.21
DISP-OE  (via drill 0.35)
  Top 0.203: U2.13 23.37,36.2 v23.37,36.27 | v31.62,31.88 79.25,31.88 84.96,37.59 84.96,38.1 83.31,39.75 v83.31,39.88 | v83.31,51.44 83.31,53.79 U1.26
  Bottom 0.203: v23.37,36.27 23.77,35.87 23.77,32.62 24.52,31.88 v31.62,31.88 | v83.31,39.88 v83.31,51.44
GND  (via drill 0.35)
  other vias: 38.73,54.61 90.04,38.99 95.12,56.52 96.65,53.09 90.04,40.77 88.9,53.59 88.77,56.39 87.63,56.39 86.61,56.39 89.79,56.39 90.81,56.39 94.11,56.52 85.6,56.39 20.45,29.21 30.48,25.4 11.43,25.4 53.34,25.4 69.85,25.4 86.36,25.4 90.81,11.43 76.83,11.43 62.87,11.43 48.9,11.43 34.92,11.43 20.95,11.43 6.99,11.43 39.75,40.77 48.9,63.5 32,59.31 20.57,59.18 9.27,59.18 11.43,41.4 15.37,41.4 19.3,41.4 66.8,46.99 96.65,51.31 96.65,50.42 96.65,49.53 96.65,48.64 96.65,47.75 59.05,53.72 36.2,38.1 61.59,38.1
  pour Top: -5.59,69.85 101.35,69.85 101.35,-5.21 -5.71,-5.21 -5.71,69.85
  pour Bottom: -9.4,72.52 103.63,72.52 103.63,-8.51 -9.4,-8.51
MIDI2-OUT  (via drill 0.35)
  Top 0.203: U1.27 82.61,53.95 82.61,54.43 82.43,54.61 v82.43,54.99 | v78.99,61.59 74.93,65.66 12.66,65.66 11.18,64.17 11.18,46.61 10.54,45.85 9.65,45.85 9.23,45.43 9.23,42.66 U5.2
  Bottom 0.203: v82.43,54.99 80.9,56.52 80.9,61.34 80.64,61.59 v78.99,61.59
MIDI-IN  (via drill 0.35)
  Top 0.203: U1.30 79.95,53.95 79.95,54.68 80.13,54.86 v80.13,55.5 | v80.14,60.71 80.14,61.85 75.82,66.17 9.27,66.17 7.43,64.33 7.43,46.67 4.2,43.44 1.33,43.44 0.94,43.05 0.94,38.43 1.14,38.23 9.75,38.23 U6.6
  Bottom 0.203: v80.13,55.5 v80.13,60.7 v80.14,60.71
MIDI-OUT  (via drill 0.35)
  Top 0.203: U1.31 79.28,54.7 79.12,54.86 v79.12,55.48 v79.11,55.49 | v79.11,60.33 74.3,65.15 23.37,65.15 22.48,64.26 22.48,46.61 21.59,45.72 19.94,45.72 19.43,45.21 U4.2
  Bottom 0.203: v79.11,55.49 v79.11,60.33
MISO
  Top 0.203: U1.16 92.56,45.24 93.98,43.81 J3.5
MOSI
  Top 0.203: U1.15 83.28,44.48 83.82,43.94 90.42,43.94 91.44,42.93 J3.6
N$1
  Top 0.203: LED1.3 14.11,10.55 14.99,11.43 18.33,11.43 LED2.1
N$2
  Top 0.203: LED3.3 41.8,10.55 42.67,11.43 46.27,11.43 LED4.1
N$3
  Top 0.203: LED2.3 28.84,10.55 29.72,11.43 32.3,11.43 LED3.1
N$4  (via drill 0.35)
  Top 0.203: LED8.1 8.8,25.4 5.33,25.4 4.83,24.89 4.83,22.61 5.33,22.1 91.69,22.1 v92.46,21.34 | v93.98,11.68 92.85,10.55 LED7.3
  Bottom 0.203: v92.46,21.34 93.98,19.81 v93.98,11.68
N$5
  Top 0.203: LED6.3 79.46,11.43 88.18,11.43 LED7.1
N$6
  Top 0.203: LED5.3 71.01,10.55 71.88,11.43 74.21,11.43 LED6.1
N$7
  Top 0.203: LED11.3 79.14,24.52 80.01,25.4 83.73,25.4 LED12.1
N$8
  Top 0.203: LED10.3 62.62,24.52 63.5,25.4 67.22,25.4 LED11.1
N$9
  Top 0.203: LED9.3 45.61,24.52 46.48,25.4 50.72,25.4 LED10.1
N$10  (via drill 0.35)
  Top 0.203: LED14.3 63.33,37.21 v62.23,37.21 | v56.6,56.54 57.66,55.48 LED16.1
  Bottom 0.203: v62.23,37.21 62.23,39.37 57.4,44.2 57.4,55.74 v56.6,56.54
N$11
  Top 0.203: LED4.3 56.27,10.55 57.15,11.43 60.24,11.43 LED5.1
N$12
  Top 0.203: LED8.3 22.75,24.52 23.62,25.4 27.86,25.4 LED9.1
N$13  (via drill 0.35)
  Top 0.203: LED16.3 62.33,53.73 62.87,54.27 v62.87,56.9 | v61.85,60.71 50.43,60.71 47.15,63.99 LED17.1
  Bottom 0.203: v62.87,56.9 62.87,59.69 v61.85,60.71
N$14
  Top 0.203: C24.2 87.62,49.13 U1.20
N$15
  Top 0.203: R12.1 26.53,44.48 26.53,61.68 J1.1
N$16
  Top 0.203: U1.8 75.81,46.73 75.3,46.22 R4.1 73.03,46.22 72.42,45.62 U$1.3
N$17
  Top 0.203: R8.1 26.94,38.73 U2.15
N$18  (via drill 0.35)
  Top 0.203: v35.94,56.77 35.94,56.53 LED15.1 37.66,56.16 47.04,56.16 47.58,55.63 v48.9,55.63 | LED17.3 51.67,61.59 v52.2,61.59
  Bottom 0.203: v52.2,61.59 52.2,58.93 v48.9,55.63
N$19  (via drill 0.35)
  Top 0.203: LED15.3 38.82,52.07 v35.18,52.07 | v33.78,40.26 34.45,39.6 LED13.1
  Bottom 0.203: v35.18,52.07 35.18,42.04 33.78,40.64 v33.78,40.26
N$20
  Top 0.203: U2.4 21.96,34.29 26.42,34.29 27.43,35.31 R8.5
N$21
  Top 0.203: U2.1 21.96,38.1 26.28,38.1 26.51,37.87 26.51,37.75 27.43,36.83 R8.2
N$22
  Top 0.203: C23.1 90.18,36.45 J3.2
N$23
  Top 0.203: U2.2 20.7,38.73 22.6,36.83 26.67,36.83 27.18,36.32 R8.3
N$24
  Top 0.203: U1.7 75.79,47.53 75.3,48.02 R4.2 73.03,48.02 72.42,48.62 U$1.1
N$25
  Top 0.203: LED1.1 4.97,12.3 4.32,12.95 4.32,17.02 5.97,18.67 93.85,18.67 95.12,19.94 R2.2
N$26
  Top 0.203: R11.1 15.37,61.59 13.63,63.33 J2.1
N$27
  Top 0.203: J4.2 1.89,44.73 R6.1
N$28
  Top 0.203: J4.1 2.08,63.33 3.94,61.47 3.94,44.58 3.16,43.8 1.13,43.8 0.53,43.2 0.53,37.69 1.27,36.96 3.91,36.96 U6.2
N$30
  Top 0.203: R8.4 26.54,35.81 26.36,35.64 23.03,35.64 21.46,37.21 20.31,37.21 U2.3
N$32
  Top 0.203: U2.5 21.96,33.02 26.42,33.02 26.92,33.53 26.92,34.29 27.43,34.8 R8.6
N$34
  Top 0.203: U2.6 21.96,31.75 26.28,31.75 27.43,32.9 27.43,33.75 27.97,34.29 R8.7
N$36
  Top 0.203: U2.7 21.88,30.56 26.36,30.56 28.33,32.53 R8.8
N$38
  Top 0.203: J1.2 24.49,46.59 23.11,45.21 R10.1
N$39
  Top 0.203: J2.2 13.19,46.59 12.7,46.1 R9.1
N$40
  Top 0.203: U4.4 21.57,43.56 25.64,43.56 R12.2
N$41
  Top 0.203: U5.4 11.29,43.69 14.47,43.69 R11.2
N$43
  Top 0.508: CN1.VBUS 91.77,57.2 F1.1
N$46  (via drill 0.35)
  Top 0.203: LED12.3 88.91,24.52 90.04,25.65 90.04,27.43 89.15,28.32 60.2,28.32 v59.05,27.18 | v58.29,40.39 59.7,38.98 LED14.1
  Bottom 0.203: v59.05,27.18 59.05,39.62 v58.29,40.39
N$47  (via drill 0.35)
  Top 0.203: SW17.B SW17.B' 52.33,59.18 R5.1 56.63,60.07 v66.04,60.07 | v66.55,57.4 R7.2
  Bottom 0.203: v66.55,57.4 66.55,59.56 v66.04,60.07
N$49
  Top 0.203: U$2.2 67.82,54.61 66.92,53.71 R7.1 65.81,53.71 C21.2
RESET  (via drill 0.35)
  Top 0.203: R1.2 75.56,55.51 76.7,56.64 80.14,56.64 80.88,55.9 U1.29 80.88,49.93 v82.04,48.77 | v83.69,33.15 C23.2
  Bottom 0.203: v82.04,48.77 82.55,48.26 82.55,33.78 83.19,33.15 v83.69,33.15 | v83.69,33.15
SCK
  Top 0.203: U1.17 91.95,46.73 95.63,43.05 95.63,40.64 J3.3
VCC  (via drill 0.35)
  Top 0.203: C7.1 86.51,10.55 | C6.1 72.54,10.55 | C5.1 58.57,10.55 | LED4.2 47.12,10.53 | LED3.2 33.15,10.53 | 5.21,10.53 LED1.2 | 19.18,10.53 LED2.2 | 61.12,10.51 LED5.2 | 28.7,24.52 LED9.2 | 9.65,24.5 LED8.2 | 82.07,24.52 C12.1 | 65.56,24.52 C11.1 | 49.05,24.52 C10.1 | 36.96,53.71 LED15.2 | 15.32,37.05 C18.1 | C9.1 26.19,24.52 | 48.88,46.37 48.9,46.35 v48.9,46.23 | D1.7SEG3 48.77,35.56 | v22.23,32.38
  Top 0.305: 15.32,37.05 U6.7 U6.8 13.47,39.71 12.7,40.48 R9.2 | U2.10 v22.23,32.38 | v25.02,29.21 C19.1 24.01,29.09 22.86,27.94 17.14,27.94 15.36,29.73 C18.1 17.11,38.84 17.11,43.38 U4.5 | C9.1 26.16,23.62 v25.65,23.11 | D1.7SEG8 48.88,46.37 | v48.9,40.51 D1.7SEG3 | v32.64,46.35 32.01,46.35 U2.16 25.66,40.12 R10.2 | 7.11,42.8 7.11,41.53 9.05,39.59 | 7.11,42.8 7.11,43.18 8.32,44.39 U5.5 | R6.2 7.1,42.79 7.11,42.8
  Top 0.406: 86.51,10.55 LED7.2 89.06,10.19 v88.01,9.14 | C7.1 85.58,9.62 76.02,9.62 LED6.2 72.54,10.55 | 58.57,10.55 LED5.2 | C1.1 5.21,10.53 | C6.1 71.64,9.65 61.98,9.65 61.12,10.51 | C5.1 57.67,9.65 48,9.65 47.12,10.53 C4.1 43.7,9.65 34.03,9.65 33.15,10.53 C3.1 29.73,9.65 20.06,9.65 19.18,10.53 C2.1 15.76,9.65 6.14,9.65 LED1.2 | 26.19,24.52 28.7,24.52 29.61,23.62 45.72,23.62 46.62,24.52 49.05,24.52 LED10.2 52.49,23.62 64.65,23.62 C11.1 | C8.1 9.65,24.5 10.53,23.62 22.86,23.62 23.74,24.5 C9.1 | 82.07,24.52 LED12.2 85,24.13 v85.98,24.13 | 65.56,24.52 LED11.2 69,23.62 81.16,23.62 C12.1 | C15.1 36.96,53.71 | 79.5,48.33 80.7,48.33 81.5,47.53 U1.18 91.08,47.53 C20.1 96.77,42.79 96.77,39.24 J3.1 | 79.5,48.33 U1.6 | 79.5,48.33 79.5,49.28 78.85,49.93 U1.4 75.04,49.93 74.17,50.8 R1.1 | 59.44,57.28 59.44,55.35 57.95,53.86 57.3,53.86 LED16.2 55.78,53.73 C16.1 | LED17.2 47.12,62.6 C17.1 43.18,61.2 43.18,57.66 | 43.18,57.66 43.56,57.28 59.44,57.28 | 58.17,59.18 59.44,57.91 59.44,57.28 | 58.17,59.18 R5.2 | 43.18,57.66 34.04,57.66 32.77,56.39 32.77,54.61 33.67,53.71 C15.1 | 58.17,59.18 71.37,59.18 | 71.37,59.18 81.28,59.18 85.72,54.74 F1.2 C22.+ 91.68,51.95 V1.2 91.68,48.13 | 34.42,37.2 34.29,37.2 34.28,37.21 v33.15,37.21 | 34.42,37.2 LED13.2 | LED14.2 57.68,37.23 C14.1 53.6,33.53 48.77,33.53 | 48.77,33.53 48.77,35.56 D1.7SEG3 | 34.42,37.2 34.43,37.2 35.56,36.07 40.41,36.07 40.51,36.06 | C15.1 33.64,53.71 32.64,52.7 v32.64,46.35 | U$2.5 71.4,59.15 71.37,59.18 | C13.1 40.51,36.06 | 9.05,39.59 U6.8 | 40.51,36.06 43.04,33.53 48.77,33.53
  Top 0.508: C20.1 91.68,48.13
  Bottom 0.203: v22.23,32.38 22.23,32
  Bottom 0.305: 22.23,32 v25.02,29.21 25.02,23.75 v25.65,23.11 | v48.9,46.23 v48.9,40.51
  Bottom 0.406: v32.64,46.35 32.64,37.72 v33.15,37.21 | v88.01,9.14 88.01,12.32 85.22,15.11 85.22,23.37 v85.98,24.13 85.47,24.64 85.47,27.94 J3.1

### Text on the board
tPlace: Maqam | Mode 2 | In - Out1 - Out2 | Mode 1 | Mode 3
bPlace: Maqam v2.0 / Chip McClelland, chip@seeinsights.com for / Mazeka INC / 12-12-2018 / All Rights Reserved